# EAGLE schematic rocketradio (EAGLE 7.5.0)
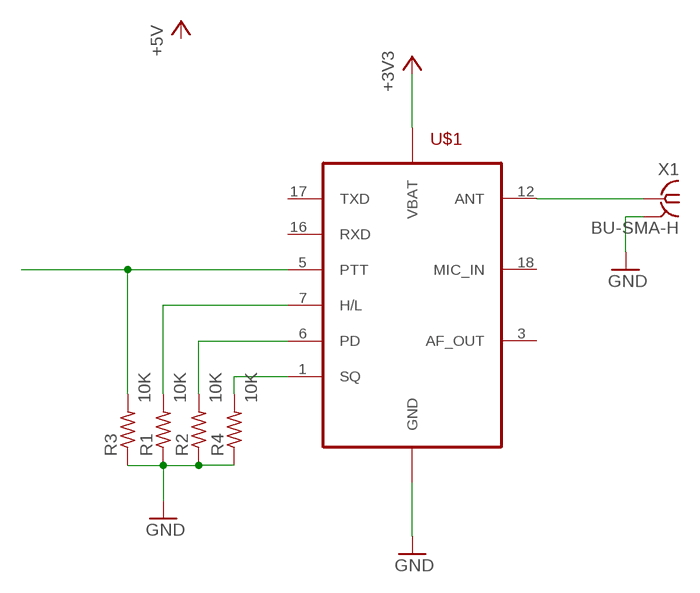
[diagram p0: schematic, sheet 1]

## Parts
R1  10K  R-US_R0603  [R0603]
R2  10K  R-US_R0603  [R0603]
R3  10K  R-US_R0603  [R0603]
R4  10K  R-US_R0603  [R0603]
U$1  DORJI  [DORJI]
X1  BU-SMA-H  [BU-SMA-H]

## Nets
+3V3: U$1.8(VBAT)
GND: R1.1 R2.1 R3.1 R4.1 U$1.9(GND) U$1.10(GND) X1.2 X1.3 X1.4 X1.5
N$1: U$1.12(ANT) X1.1
N$2: R1.2 U$1.7(H/L)
N$3: R2.2 U$1.6(PD)
N$4: R3.2 U$1.5(PTT)
N$5: R4.2 U$1.1(SQ)
Unconnected: U$1.3(AF_OUT) U$1.16(RXD) U$1.17(TXD) U$1.18(MIC_IN)

## Library data of the parts
R1-R4 = rcl:R-US_: RESISTOR, American symbol
U$1 = dorji:DORJI: DRA818V 2-Meter transceiver modul
X1 = con-coax:BU-SMA-H: FEMALE SMA CONNECTOR Radiall; OC_FARNELL: unknown; OC_NEWARK: unknown